# EAGLE schematic proto (EAGLE 4.13)
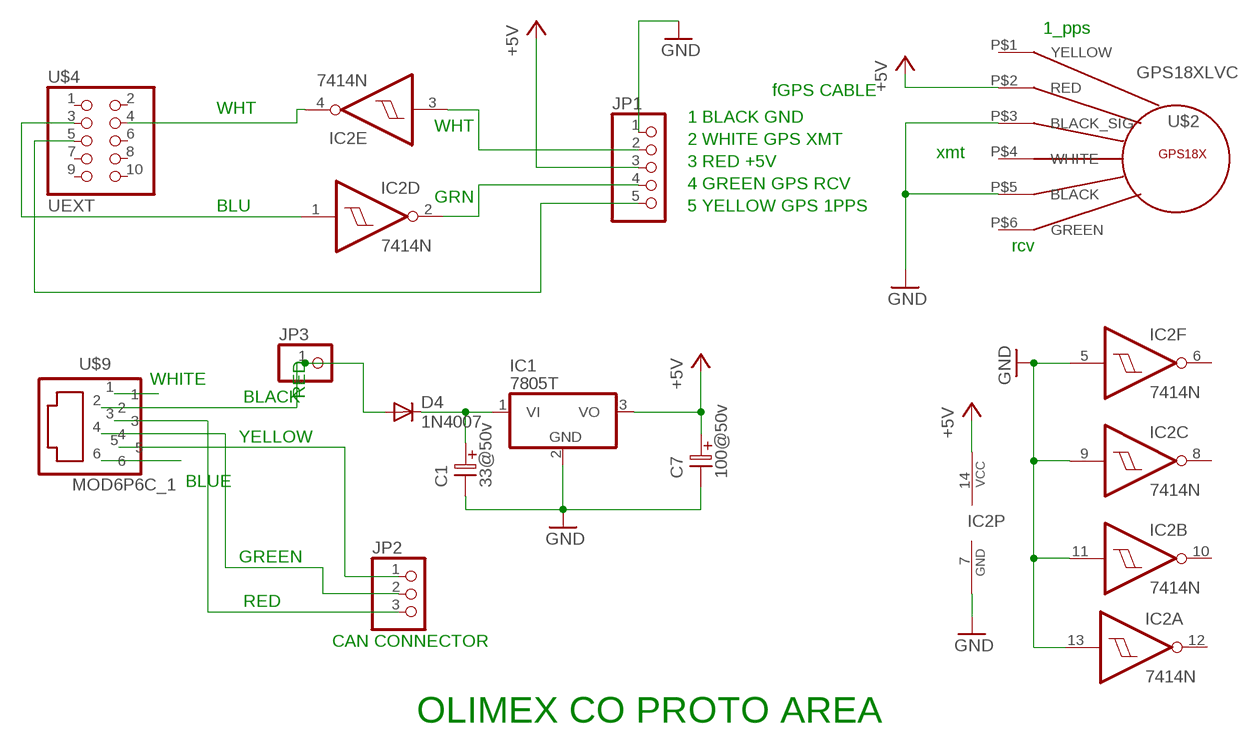
[diagram p0: schematic, sheet 1]

## Parts
C1  33@50v  ELC-2,5  [ES-2,5]
C7  100@50v  ELC-2,5  [ES-2,5]
D4  1N4007  1N4004_VERT  [DO41-10_VERT]
IC1  7805T  [TO220H]
IC2  7414N  [DIL14]
JP1  PINHD-1X5  [1X05]
JP2  PINHD-1X3  [1X03]
JP3  PINHD-1X1  [1X01]
U$2  GPS18XLVC  [GPS18XLVC]
U$4  UEXT  PINHD-2X5_KEYED  [2X05_KEYED]
U$9  MOD6P6C_1  [MOD6P6C_1]

## Nets
+5V: C7.1 IC1.3(VO) IC2.14(P:VCC) JP1.3 U$2.P$2(RED)
+8V: D4.A JP3.1 U$9.2
CANH: JP2.3 U$9.3
CANL: JP2.2 U$9.4
GND: C1.2 C7.2 IC1.2(GND) IC2.5(F:I) IC2.7(P:GND) IC2.9(C:I) IC2.11(B:I) IC2.13(A:I) JP1.1 U$2.P$3(BLACK_SIG) U$2.P$5(BLACK)
N$1: IC2.2(D:O) JP1.4
N$2: IC2.3(E:I) JP1.2
N$3: C1.1 D4.C IC1.1(VI)
N$4: U$9.1
N$5: IC2.1(D:I) U$4.3
N$6: JP1.5 U$4.5
N$7: IC2.4(E:O) U$4.4
N$8: U$9.6
N$9: JP2.1 U$9.5
Unconnected: IC2.6(F:O) IC2.8(C:O) IC2.10(B:O) IC2.12(A:O) U$2.P$1(YELLOW) U$2.P$4(WHITE) U$2.P$6(GREEN) U$4.1 U$4.2 U$4.6 U$4.7 U$4.8 U$4.9 U$4.10

## Notes on the sheet
- 1_pps
- fGPS CABLE
- WHT
- 1 BLACK GND
- WHT
- 2 WHITE GPS XMT
- xmt
- 3 RED +5V
- 4 GREEN GPS RCV
- GRN
- BLU | 5 YELLOW GPS 1PPS
- rcv
- WHITE
- BLACK | RED
- YELLOW
- BLUE
- GREEN
- RED
- CAN CONNECTOR
- OLIMEX CO PROTO AREA

## Library data of the parts
C1 C7 = DEH:ELC-2,5
D4 = diode:1N4004_VERT
IC1 = linear:78*: Positive VOLTAGE REGULATOR
IC2 = 74xx-us:74*14: Hex schmitt trigger INVERTER
JP1 = pinhead:PINHD-1X5: PIN HEADER
JP2 = pinhead:PINHD-1X3: PIN HEADER
JP3 = pinhead:PINHD-1X1: PIN HEADER
U$2 = DEH:GPS18XLVC
U$4 = pinhead:PINHD-2X5_KEYED
U$9 = DEH:MOD6P6C_1